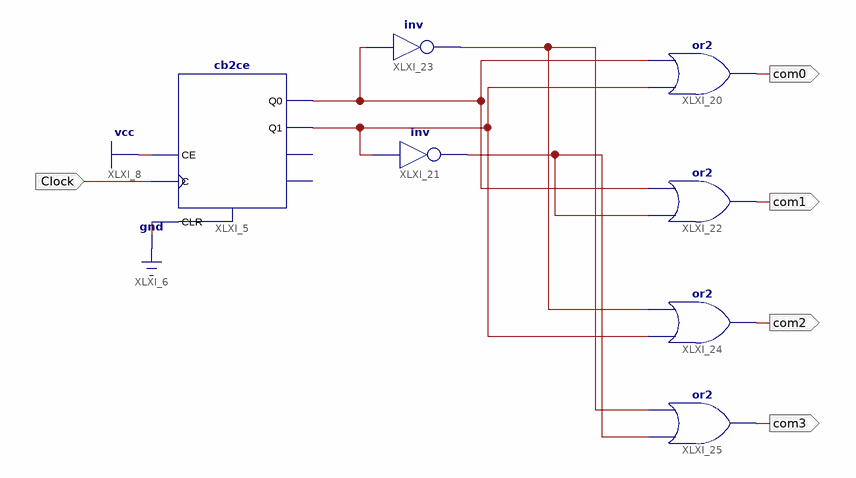
[diagram p0: schematic sheet 1]
// Xilinx ISE schematic selectCommon.sch (spartan6) as structural Verilog: 7 symbols, 5 ports
module selectCommon (
  input  Clock,
  output com0,
  output com1,
  output com2,
  output com3
);

  wire XLXN_46, XLXN_47, XLXN_50, XLXN_51;

  cb2ce XLXI_5 (.C(Clock), .CE(1'b1), .CLR(1'b0), .Q0(XLXN_50), .Q1(XLXN_46));  // open: CEO, TC
  or XLXI_20 (com0, XLXN_46, XLXN_50);
  not XLXI_21 (XLXN_47, XLXN_46);
  or XLXI_22 (com1, XLXN_47, XLXN_50);
  not XLXI_23 (XLXN_51, XLXN_50);
  or XLXI_24 (com2, XLXN_46, XLXN_51);
  or XLXI_25 (com3, XLXN_47, XLXN_51);
endmodule
